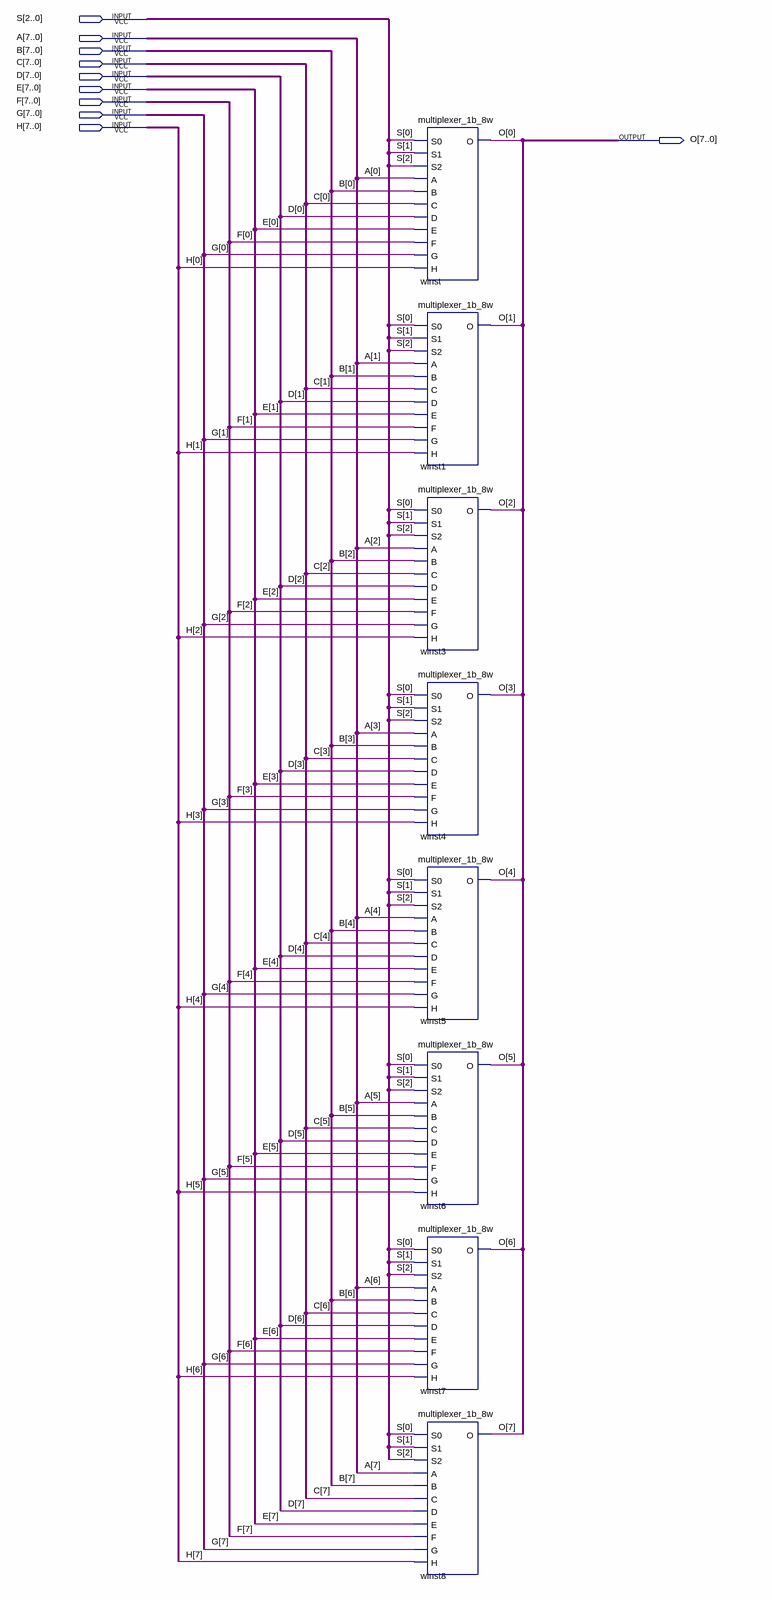
[diagram p0: schematic sheet]
// Quartus schematic multiplexer_8b_8w.bdf as structural Verilog: 8 symbols, 10 pins
module multiplexer_8b_8w (
  input  [2:0] S,
  input  [7:0] A,
  input  [7:0] B,
  input  [7:0] C,
  input  [7:0] D,
  input  [7:0] E,
  input  [7:0] F,
  input  [7:0] G,
  input  [7:0] H,
  output [7:0] O
);

  multiplexer_1b_8w winst (
    .S0(S[0]), .S1(S[1]), .S2(S[2]), .A(A[0]), .B(B[0]), .C(C[0]), .D(D[0]), .E(E[0]), .F(F[0]), .G(G[0]),
    .H(H[0]), .O(O[0]));
  multiplexer_1b_8w winst1 (
    .S0(S[0]), .S1(S[1]), .S2(S[2]), .A(A[1]), .B(B[1]), .C(C[1]), .D(D[1]), .E(E[1]), .F(F[1]), .G(G[1]),
    .H(H[1]), .O(O[1]));
  multiplexer_1b_8w winst3 (
    .S0(S[0]), .S1(S[1]), .S2(S[2]), .A(A[2]), .B(B[2]), .C(C[2]), .D(D[2]), .E(E[2]), .F(F[2]), .G(G[2]),
    .H(H[2]), .O(O[2]));
  multiplexer_1b_8w winst4 (
    .S0(S[0]), .S1(S[1]), .S2(S[2]), .A(A[3]), .B(B[3]), .C(C[3]), .D(D[3]), .E(E[3]), .F(F[3]), .G(G[3]),
    .H(H[3]), .O(O[3]));
  multiplexer_1b_8w winst5 (
    .S0(S[0]), .S1(S[1]), .S2(S[2]), .A(A[4]), .B(B[4]), .C(C[4]), .D(D[4]), .E(E[4]), .F(F[4]), .G(G[4]),
    .H(H[4]), .O(O[4]));
  multiplexer_1b_8w winst6 (
    .S0(S[0]), .S1(S[1]), .S2(S[2]), .A(A[5]), .B(B[5]), .C(C[5]), .D(D[5]), .E(E[5]), .F(F[5]), .G(G[5]),
    .H(H[5]), .O(O[5]));
  multiplexer_1b_8w winst7 (
    .S0(S[0]), .S1(S[1]), .S2(S[2]), .A(A[6]), .B(B[6]), .C(C[6]), .D(D[6]), .E(E[6]), .F(F[6]), .G(G[6]),
    .H(H[6]), .O(O[6]));
  multiplexer_1b_8w winst8 (
    .S0(S[0]), .S1(S[1]), .S2(S[2]), .A(A[7]), .B(B[7]), .C(C[7]), .D(D[7]), .E(E[7]), .F(F[7]), .G(G[7]),
    .H(H[7]), .O(O[7]));
endmodule
